# EAGLE schematic 0a_cpu_mmu (EAGLE 6.6.0)

## Sheet 1 of 2
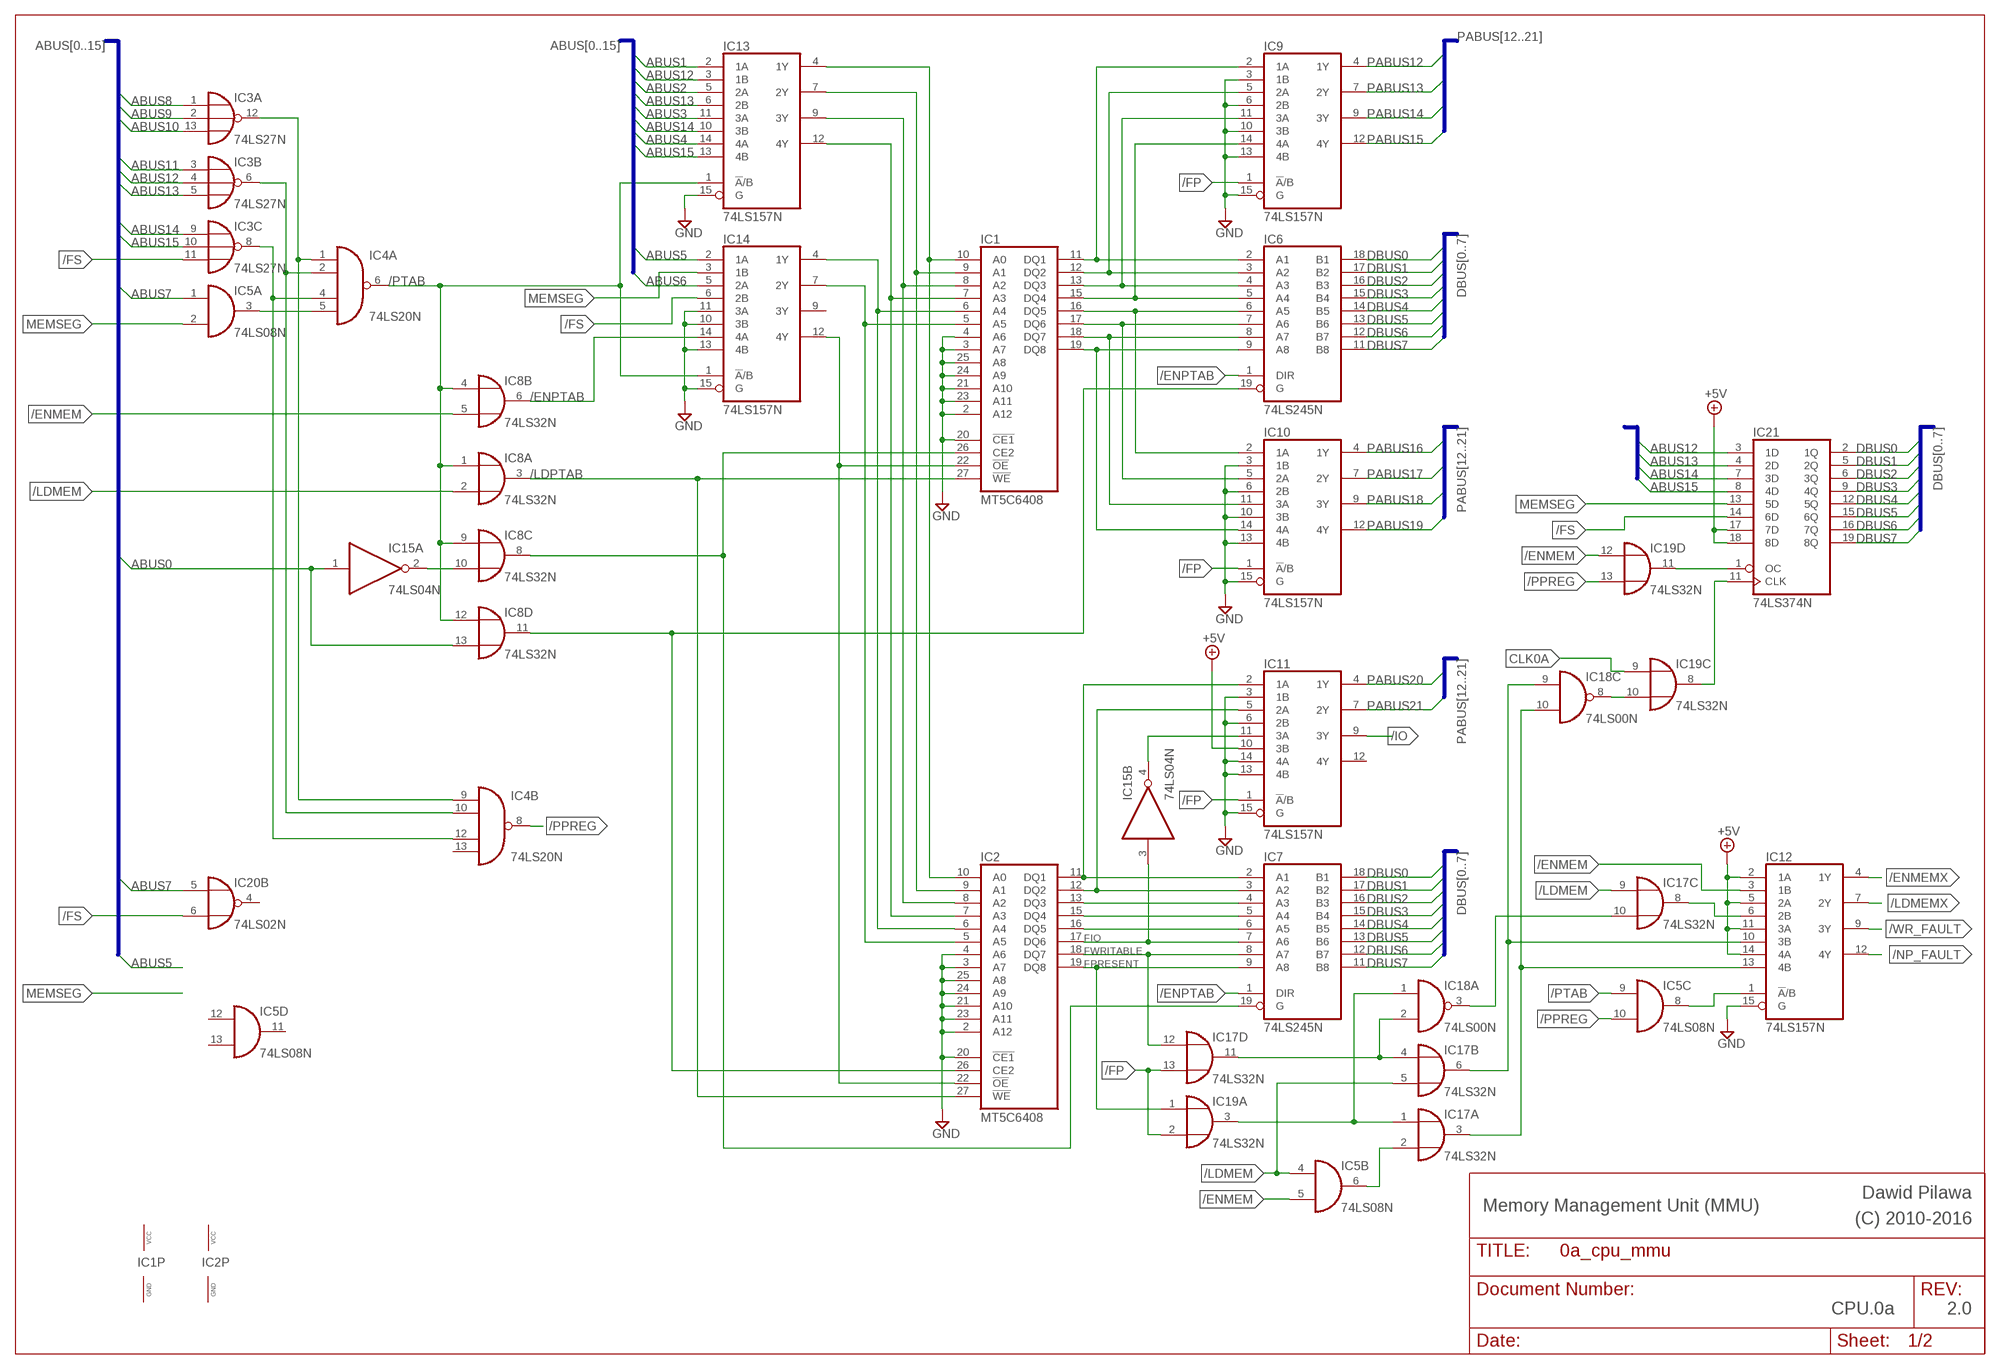
[diagram p0: schematic, sheet 1]

### Parts
IC1  MT5C6408  [DIL28-3]
IC2  MT5C6408  [DIL28-3]
IC3  74LS27N  [DIL14]
IC4  74LS20N  [DIL14]
IC5  74LS08N  [DIL14]
IC6  74LS245N  [DIL20]
IC7  74LS245N  [DIL20]
IC8  74LS32N  [DIL14]
IC9  74LS157N  [DIL16]
IC10  74LS157N  [DIL16]
IC11  74LS157N  [DIL16]
IC12  74LS157N  [DIL16]
IC13  74LS157N  [DIL16]
IC14  74LS157N  [DIL16]
IC15  74LS04N  [DIL14]
IC17  74LS32N  [DIL14]
IC18  74LS00N  [DIL14]
IC19  74LS32N  [DIL14]
IC20  74LS02N  [DIL14]
IC21  74LS374N  [DIL20]

### Nets
+5V: IC11.10(3B) IC12.2(1A) IC12.5(2A) IC12.11(3A) IC12.14(4A) IC21.17(7D) IC21.18(8D) ; also sheet 2
/ENMEM: IC5.5(B:I1) IC8.5(B:I1) IC12.3(1B) IC19.12(D:I0) ; also sheet 2
/ENMEMX: IC12.4(1Y)
/ENPTAB: IC6.1(DIR) IC7.1(DIR) IC8.6(B:O) IC14.14(4A)
/FP: IC9.1(!A!/B) IC10.1(!A!/B) IC11.1(!A!/B) IC17.13(D:I1) IC19.2(A:I1) ; also sheet 2
/FS: IC3.11(C:I2) IC14.6(2B) IC20.6(B:I1) IC21.14(6D) ; also sheet 2
/IO: IC11.9(3Y) ; also sheet 2
/LDMEM: IC5.4(B:I0) IC8.2(A:I1) IC17.5(B:I1) IC17.9(C:I0) ; also sheet 2
/LDMEMX: IC12.7(2Y)
/LDPTAB: IC1.27(!WE) IC2.27(!WE) IC8.3(A:O)
/NP_FAULT: IC12.12(4Y) ; also sheet 2
/PPREG: IC4.8(B:O) IC5.10(C:I1) IC19.13(D:I1)
/PTAB: IC4.6(A:O) IC5.9(C:I0) IC8.1(A:I0) IC8.4(B:I0) IC8.9(C:I0) IC8.12(D:I0) IC13.1(!A!/B) IC14.1(!A!/B)
/WR_FAULT: IC12.9(3Y) ; also sheet 2
ABUS0: IC8.13(D:I1) IC15.1(A:I) ; also sheet 2
ABUS1: IC13.2(1A) ; also sheet 2
ABUS2: IC13.5(2A) ; also sheet 2
ABUS3: IC13.11(3A) ; also sheet 2
ABUS4: IC13.14(4A) ; also sheet 2
ABUS5: IC14.2(1A) ; also sheet 2
ABUS6: IC14.5(2A) ; also sheet 2
ABUS7: IC5.1(A:I0) IC20.5(B:I0) ; also sheet 2
ABUS8: IC3.1(A:I0) ; also sheet 2
ABUS9: IC3.2(A:I1) ; also sheet 2
ABUS10: IC3.13(A:I2) ; also sheet 2
ABUS11: IC3.3(B:I0) ; also sheet 2
ABUS12: IC3.4(B:I1) IC13.3(1B) IC21.3(1D) ; also sheet 2
ABUS13: IC3.5(B:I2) IC13.6(2B) IC21.4(2D) ; also sheet 2
ABUS14: IC3.9(C:I0) IC13.10(3B) IC21.7(3D) ; also sheet 2
ABUS15: IC3.10(C:I1) IC13.13(4B) IC21.8(4D) ; also sheet 2
CLK0A: IC19.9(C:I0) ; also sheet 2
DBUS0: IC6.18(B1) IC7.18(B1) IC21.2(1Q) ; also sheet 2
DBUS1: IC6.17(B2) IC7.17(B2) IC21.5(2Q) ; also sheet 2
DBUS2: IC6.16(B3) IC7.16(B3) IC21.6(3Q) ; also sheet 2
DBUS3: IC6.15(B4) IC7.15(B4) IC21.9(4Q) ; also sheet 2
DBUS4: IC6.14(B5) IC7.14(B5) IC21.12(5Q) ; also sheet 2
DBUS5: IC6.13(B6) IC7.13(B6) IC21.15(6Q) ; also sheet 2
DBUS6: IC6.12(B7) IC7.12(B7) IC21.16(7Q) ; also sheet 2
DBUS7: IC6.11(B8) IC7.11(B8) IC21.19(8Q) ; also sheet 2
FIO: IC2.17(DQ6) IC7.7(A6) IC15.3(B:I)
FPRESENT: IC2.19(DQ8) IC7.9(A8) IC19.1(A:I0)
FWRITABLE: IC2.18(DQ7) IC7.8(A7) IC17.12(D:I0)
GND: IC1.2(A12) IC1.3(A7) IC1.4(A6) IC1.20(!CE1) IC1.21(A10) IC1.23(A11) IC1.24(A9) IC1.25(A8) IC2.2(A12) IC2.3(A7) IC2.4(A6) IC2.20(!CE1) IC2.21(A10) IC2.23(A11) IC2.24(A9) IC2.25(A8) IC9.3(1B) IC9.6(2B) IC9.10(3B) IC9.13(4B) IC9.15(G) IC10.3(1B) IC10.6(2B) IC10.10(3B) IC10.13(4B) IC10.15(G) IC11.3(1B) IC11.6(2B) IC11.13(4B) IC11.14(4A) IC11.15(G) IC12.15(G) IC13.15(G) IC14.10(3B) IC14.11(3A) IC14.13(4B) IC14.15(G) ; also sheet 2
MEMSEG: IC5.2(A:I1) IC14.3(1B) IC21.13(5D) ; also sheet 2
N$1: IC3.12(A:O) IC4.1(A:I0) IC4.9(B:I0)
N$2: IC3.6(B:O) IC4.2(A:I1) IC4.10(B:I1)
N$4: IC4.5(A:I3) IC5.3(A:O)
N$5: IC1.11(DQ1) IC6.2(A1) IC9.2(1A)
N$6: IC1.12(DQ2) IC6.3(A2) IC9.5(2A)
N$7: IC1.13(DQ3) IC6.4(A3) IC9.11(3A)
N$8: IC1.15(DQ4) IC6.5(A4) IC9.14(4A)
N$9: IC1.16(DQ5) IC6.6(A5) IC10.2(1A)
N$10: IC1.17(DQ6) IC6.7(A6) IC10.5(2A)
N$11: IC1.18(DQ7) IC6.8(A7) IC10.11(3A)
N$12: IC1.19(DQ8) IC6.9(A8) IC10.14(4A)
N$13: IC2.11(DQ1) IC7.2(A1) IC11.2(1A)
N$14: IC2.12(DQ2) IC7.3(A2) IC11.5(2A)
N$15: IC2.13(DQ3) IC7.4(A3)
N$16: IC2.15(DQ4) IC7.5(A4)
N$17: IC2.16(DQ5) IC7.6(A5)
N$18: IC11.11(3A) IC15.4(B:O)
N$19: IC5.6(B:O) IC17.2(A:I1)
N$20: IC12.6(2B) IC17.8(C:O)
N$21: IC1.10(A0) IC2.10(A0) IC13.4(1Y)
N$22: IC1.9(A1) IC2.9(A1) IC13.7(2Y)
N$23: IC1.8(A2) IC2.8(A2) IC13.9(3Y)
N$24: IC1.7(A3) IC2.7(A3) IC13.12(4Y)
N$25: IC1.6(A4) IC2.6(A4) IC14.4(1Y)
N$26: IC1.5(A5) IC2.5(A5) IC14.7(2Y)
N$27: IC1.26(CE2) IC7.19(G) IC8.8(C:O)
N$28: IC2.26(CE2) IC6.19(G) IC8.11(D:O)
N$29: IC1.22(!OE) IC2.22(!OE) IC14.12(4Y)
N$30: IC8.10(C:I1) IC15.2(A:O)
N$31: IC12.10(3B) IC17.6(B:O) IC18.9(C:I0)
N$32: IC12.13(4B) IC17.3(A:O) IC18.10(C:I1)
N$33: IC17.10(C:I1) IC18.3(A:O)
N$34: IC17.4(B:I0) IC17.11(D:O) IC18.2(A:I1)
N$35: IC17.1(A:I0) IC18.1(A:I0) IC19.3(A:O)
N$37: IC3.8(C:O) IC4.4(A:I2) IC4.12(B:I2)
N$39: IC5.8(C:O) IC12.1(!A!/B)
N$40: IC18.8(C:O) IC19.10(C:I1)
N$41: IC19.8(C:O) IC21.11(CLK)
N$42: IC19.11(D:O) IC21.1(OC)
PABUS12: IC9.4(1Y) ; also sheet 2
PABUS13: IC9.7(2Y) ; also sheet 2
PABUS14: IC9.9(3Y) ; also sheet 2
PABUS15: IC9.12(4Y) ; also sheet 2
PABUS16: IC10.4(1Y) ; also sheet 2
PABUS17: IC10.7(2Y) ; also sheet 2
PABUS18: IC10.9(3Y) ; also sheet 2
PABUS19: IC10.12(4Y) ; also sheet 2
PABUS20: IC11.4(1Y) ; also sheet 2
PABUS21: IC11.7(2Y) ; also sheet 2
Unconnected: IC4.13(B:I3) IC5.11(D:O) IC5.12(D:I0) IC5.13(D:I1) IC11.12(4Y) IC14.9(3Y) IC15.5(C:I) IC15.6(C:O) IC15.8(D:O) IC15.9(D:I) IC15.10(E:O) IC15.11(E:I) IC15.12(F:O) IC15.13(F:I) IC18.4(B:I0) IC18.5(B:I1) IC18.6(B:O) IC18.11(D:O) IC18.12(D:I0) IC18.13(D:I1) IC19.4(B:I0) IC19.5(B:I1) IC19.6(B:O) IC20.1(A:O) IC20.2(A:I0) IC20.3(A:I1) IC20.4(B:O) IC20.8(C:I0) IC20.9(C:I1) IC20.10(C:O) IC20.11(D:I0) IC20.12(D:I1) IC20.13(D:O)

### Buses
ABUS[0..15]
DBUS[0..7]
PABUS[12..21]

### Notes on the sheet
- Dawid Pilawa
- Memory Management Unit (MMU) | (C) 2010-2016
- CPU.0a | 2.0

## Sheet 2 of 2
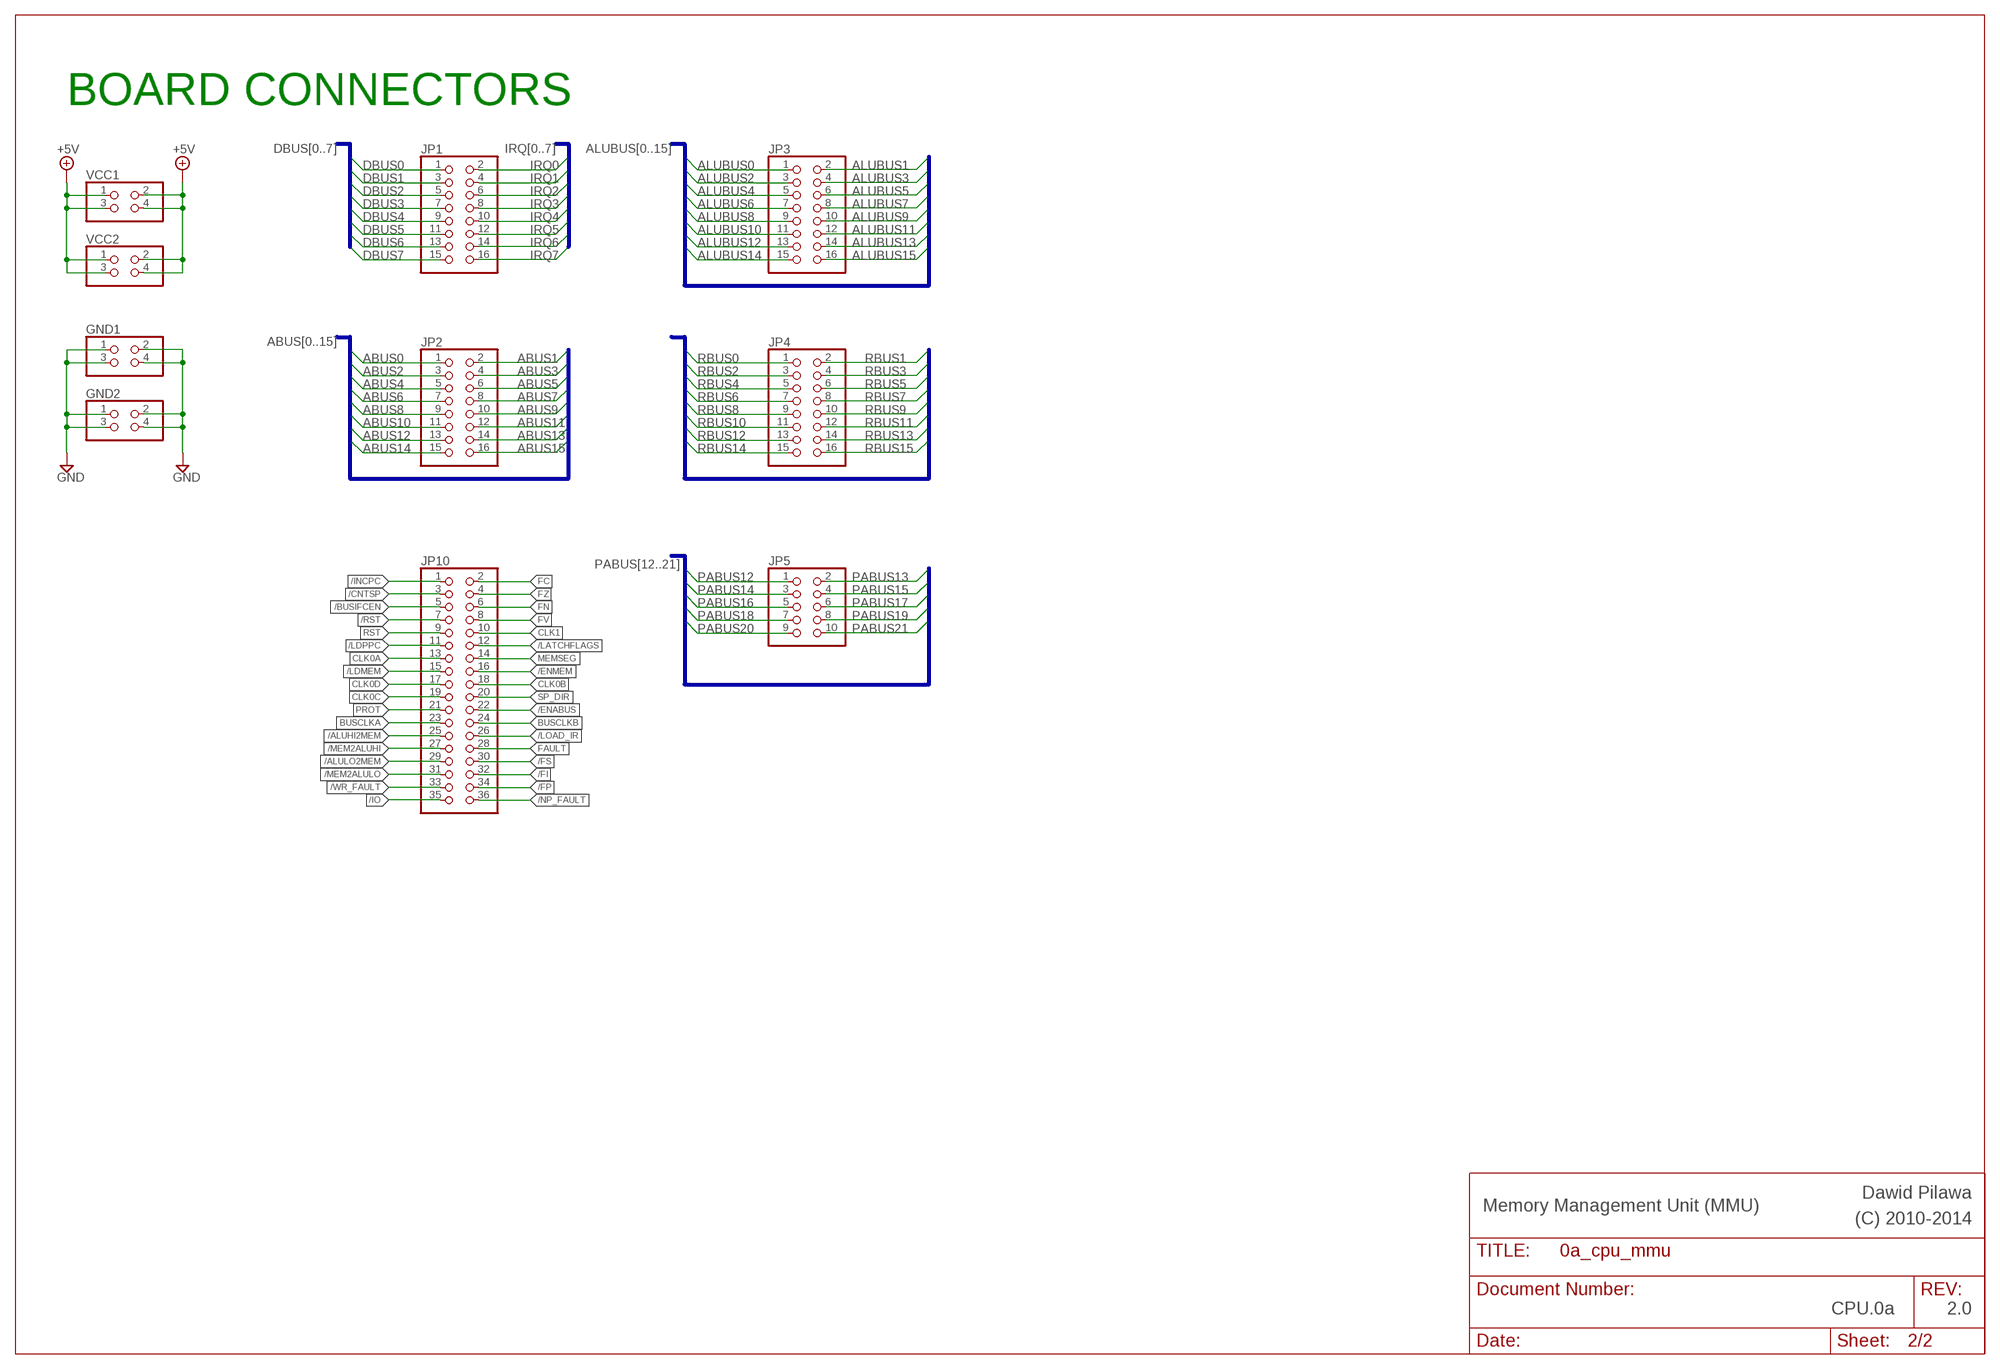
[diagram p1: schematic, sheet 2]

### Parts
GND1  PINHD-2X2  [2X02]
GND2  PINHD-2X2  [2X02]
JP1  PINHD-2X8  [2X08]
JP2  PINHD-2X8  [2X08]
JP3  PINHD-2X8  [2X08]
JP4  PINHD-2X8  [2X08]
JP5  PINHD-2X5  [2X05]
JP10  PINHD-2X18  [2X18]
VCC1  PINHD-2X2  [2X02]
VCC2  PINHD-2X2  [2X02]

### Nets
+5V: VCC1.1 VCC1.2 VCC1.3 VCC1.4 VCC2.1 VCC2.2 VCC2.3 VCC2.4 ; also sheet 1
/ALUHI2MEM: JP10.25
/ALULO2MEM: JP10.29
/BUSIFCEN: JP10.5
/CNTSP: JP10.3
/ENABUS: JP10.22
/ENMEM: JP10.16 ; also sheet 1
/FI: JP10.32
/FP: JP10.34 ; also sheet 1
/FS: JP10.30 ; also sheet 1
/INCPC: JP10.1
/IO: JP10.35 ; also sheet 1
/LATCHFLAGS: JP10.12
/LDMEM: JP10.15 ; also sheet 1
/LDPPC: JP10.11
/LOAD_IR: JP10.26
/MEM2ALUHI: JP10.27
/MEM2ALULO: JP10.31
/NP_FAULT: JP10.36 ; also sheet 1
/RST: JP10.7
/WR_FAULT: JP10.33 ; also sheet 1
ABUS0: JP2.1 ; also sheet 1
ABUS1: JP2.2 ; also sheet 1
ABUS2: JP2.3 ; also sheet 1
ABUS3: JP2.4 ; also sheet 1
ABUS4: JP2.5 ; also sheet 1
ABUS5: JP2.6 ; also sheet 1
ABUS6: JP2.7 ; also sheet 1
ABUS7: JP2.8 ; also sheet 1
ABUS8: JP2.9 ; also sheet 1
ABUS9: JP2.10 ; also sheet 1
ABUS10: JP2.11 ; also sheet 1
ABUS11: JP2.12 ; also sheet 1
ABUS12: JP2.13 ; also sheet 1
ABUS13: JP2.14 ; also sheet 1
ABUS14: JP2.15 ; also sheet 1
ABUS15: JP2.16 ; also sheet 1
ALUBUS0: JP3.1
ALUBUS1: JP3.2
ALUBUS2: JP3.3
ALUBUS3: JP3.4
ALUBUS4: JP3.5
ALUBUS5: JP3.6
ALUBUS6: JP3.7
ALUBUS7: JP3.8
ALUBUS8: JP3.9
ALUBUS9: JP3.10
ALUBUS10: JP3.11
ALUBUS11: JP3.12
ALUBUS12: JP3.13
ALUBUS13: JP3.14
ALUBUS14: JP3.15
ALUBUS15: JP3.16
BUSCLKA: JP10.23
BUSCLKB: JP10.24
CLK0A: JP10.13 ; also sheet 1
CLK0B: JP10.18
CLK0C: JP10.19
CLK0D: JP10.17
CLK1: JP10.10
DBUS0: JP1.1 ; also sheet 1
DBUS1: JP1.3 ; also sheet 1
DBUS2: JP1.5 ; also sheet 1
DBUS3: JP1.7 ; also sheet 1
DBUS4: JP1.9 ; also sheet 1
DBUS5: JP1.11 ; also sheet 1
DBUS6: JP1.13 ; also sheet 1
DBUS7: JP1.15 ; also sheet 1
FAULT: JP10.28
FC: JP10.2
FN: JP10.6
FV: JP10.8
FZ: JP10.4
GND: GND1.1 GND1.2 GND1.3 GND1.4 GND2.1 GND2.2 GND2.3 GND2.4 ; also sheet 1
IRQ0: JP1.2
IRQ1: JP1.4
IRQ2: JP1.6
IRQ3: JP1.8
IRQ4: JP1.10
IRQ5: JP1.12
IRQ6: JP1.14
IRQ7: JP1.16
MEMSEG: JP10.14 ; also sheet 1
PABUS12: JP5.1 ; also sheet 1
PABUS13: JP5.2 ; also sheet 1
PABUS14: JP5.3 ; also sheet 1
PABUS15: JP5.4 ; also sheet 1
PABUS16: JP5.5 ; also sheet 1
PABUS17: JP5.6 ; also sheet 1
PABUS18: JP5.7 ; also sheet 1
PABUS19: JP5.8 ; also sheet 1
PABUS20: JP5.9 ; also sheet 1
PABUS21: JP5.10 ; also sheet 1
PROT: JP10.21
RBUS0: JP4.1
RBUS1: JP4.2
RBUS2: JP4.3
RBUS3: JP4.4
RBUS4: JP4.5
RBUS5: JP4.6
RBUS6: JP4.7
RBUS7: JP4.8
RBUS8: JP4.9
RBUS9: JP4.10
RBUS10: JP4.11
RBUS11: JP4.12
RBUS12: JP4.13
RBUS13: JP4.14
RBUS14: JP4.15
RBUS15: JP4.16
RST: JP10.9
SP_DIR: JP10.20

### Buses
DBUS[0..7]
ALUBUS[0..15]
RBUS[0..15]
IRQ[0..7]
ABUS[0..15]
PABUS[12..21]

### Notes on the sheet
- BOARD CONNECTORS
- Dawid Pilawa
- Memory Management Unit (MMU) | (C) 2010-2014
- CPU.0a | 2.0

## Power pins joined to a net without a drawn wire
GND: IC1.14(GND) IC2.14(GND) IC3.7(P:GND) IC4.7(P:GND) IC5.7(P:GND) IC6.10(GND) IC7.10(GND) IC8.7(P:GND) IC9.8(GND) IC10.8(GND) IC11.8(GND) IC12.8(GND) IC13.8(GND) IC14.8(GND) IC15.7(P:GND) IC17.7(P:GND) IC18.7(P:GND) IC19.7(P:GND) IC20.7(P:GND) IC21.10(GND)
VCC: IC1.28(VCC) IC2.28(VCC) IC3.14(P:VCC) IC4.14(P:VCC) IC5.14(P:VCC) IC6.20(VCC) IC7.20(VCC) IC8.14(P:VCC) IC9.16(VCC) IC10.16(VCC) IC11.16(VCC) IC12.16(VCC) IC13.16(VCC) IC14.16(VCC) IC15.14(P:VCC) IC17.14(P:VCC) IC18.14(P:VCC) IC19.14(P:VCC) IC20.14(P:VCC) IC21.20(VCC)

## Library data of the parts
GND1 GND2 VCC1 VCC2 = pinhead:PINHD-2X2: PIN HEADER
IC1 IC2 = dawid:MT5C6408: 8K x 8 SRAM SRAM MEMORY ARRAY
IC3 = 74xx-eu:74*27: Triple 3-input NOR gate
IC4 = 74xx-eu:74*20: Dual 4-input NAND gate
IC5 = 74xx-eu:74*08: Quad 2-input AND gate
IC6 IC7 = 74xx-eu:74*245: Octal BUS TRANSCEIVER, 3-state
IC8 IC17 IC19 = 74xx-eu:74*32: Quad 2-input OR gate
IC9-IC14 = 74xx-eu:74*157: Quadruple 2-line to 1-line data SELECTOR/MULTIPLEXER
IC15 = 74xx-eu:74*04: Hex INVERTER
IC18 = 74xx-eu:74*00: Quad 2-input NAND gate
IC20 = 74xx-eu:74*02: Quad 2-input NOR gate
IC21 = 74xx-eu:74*374: Octal D type transparent LATCH, edge triggered
JP1-JP4 = pinhead:PINHD-2X8: PIN HEADER
JP5 = pinhead:PINHD-2X5: PIN HEADER
JP10 = pinhead:PINHD-2X18: PIN HEADER